# EAGLE design damp_v0002 (EAGLE 6.4)

## Sheet 1 of 2: DAC
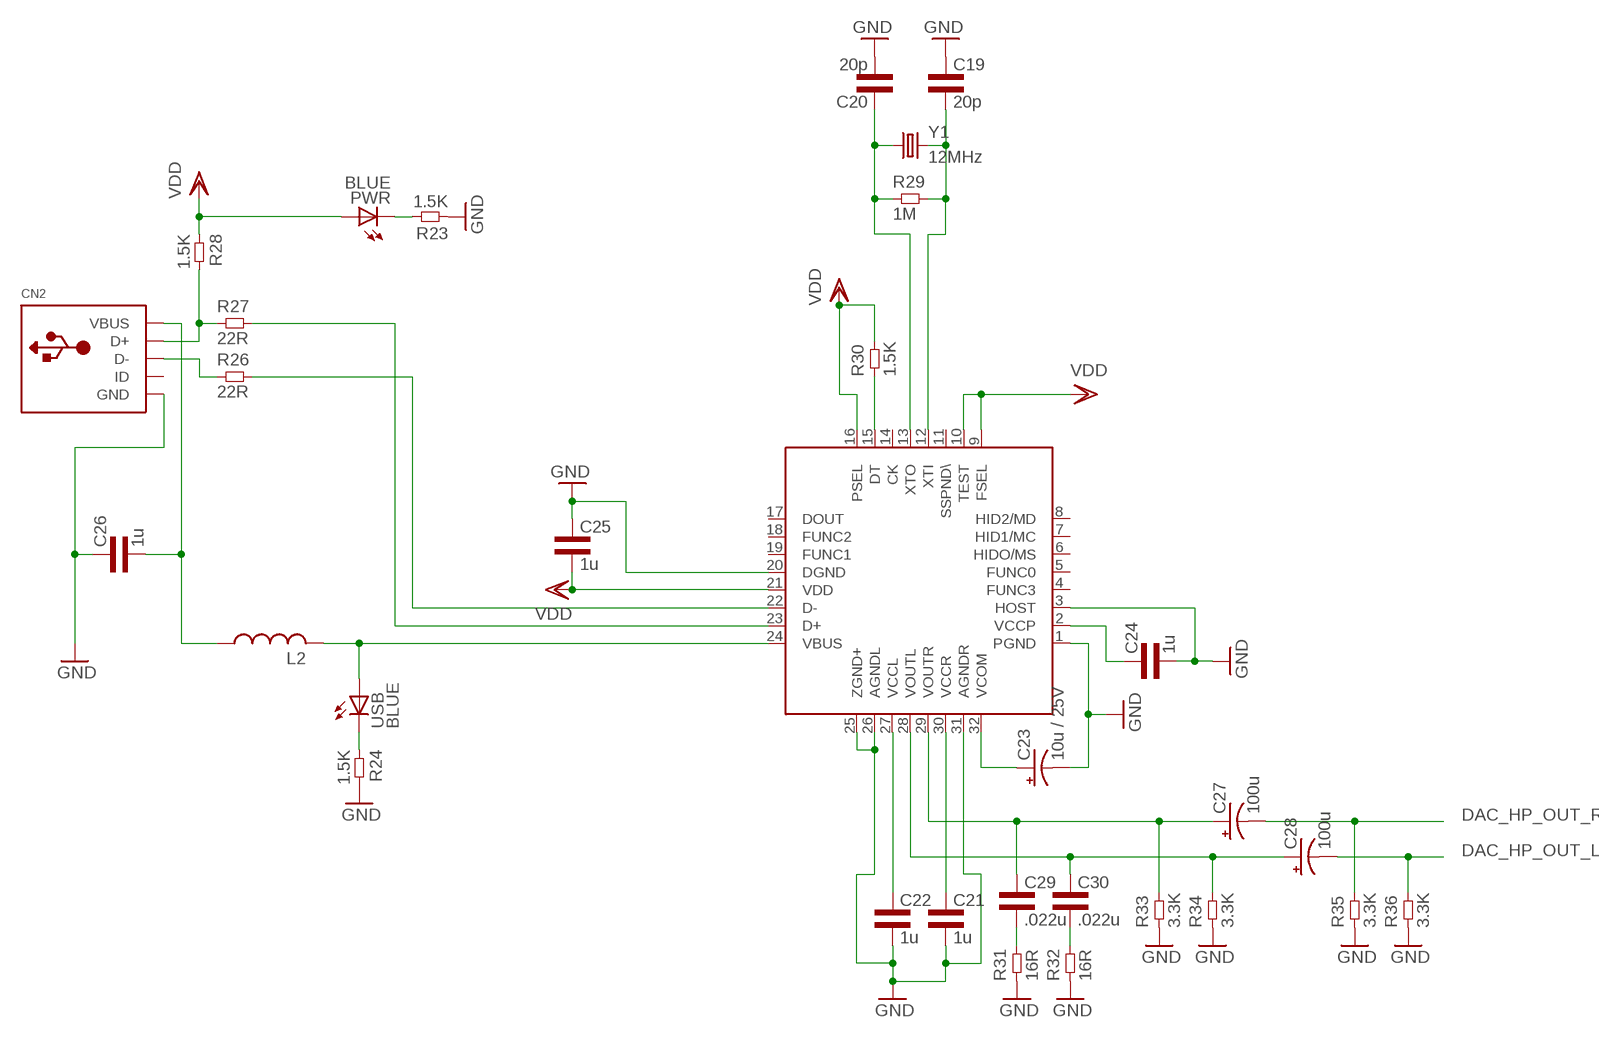
[diagram p0: schematic, sheet 1]

### Parts
C19  20p  CAP0603L3  [0603L3]
C20  20p  CAP0603L3  [0603L3]
C21  1u  CAP0603L3  [0603L3]
C22  1u  CAP0603L3  [0603L3]
C23  10u / 25V  CPOL-USE1.8-4  [E1,8-4]
C24  1u  CAP0603L3  [0603L3]
C25  1u  CAP0603L3  [0603L3]
C26  1u  CAP0603L3  [0603L3]
C27  100u  CPOL-USE2-5  [E2-5]
C28  100u  CPOL-USE2-5  [E2-5]
C29  .022u  CAP0603L3  [0603L3]
C30  .022u  CAP0603L3  [0603L3]
CN2  USBMINIB  [USB-MINIB]
L2  RCL_L-USL3225M  [RCL_L3225M]
PWR  BLUE  LED-BLUE0603  [LED-0603]
R23  1.5K  RES0603L3  [0603L3]
R24  1.5K  RES0603L3  [0603L3]
R26  22R  RES0603L3  [0603L3]
R27  22R  RES0603L3  [0603L3]
R28  1.5K  RES0603L3  [0603L3]
R29  1M  RES0603L3  [0603L3]
R30  1.5K  RES0603L3  [0603L3]
R31  16R  RES0603L3  [0603L3]
R32  16R  RES0603L3  [0603L3]
R33  3.3K  RES0603L3  [0603L3]
R34  3.3K  RES0603L3  [0603L3]
R35  3.3K  RES0603L3  [0603L3]
R36  3.3K  RES0603L3  [0603L3]
U$1  PCM2707_V1_PCM2704C_PCM2707  [PCM2707_V1_PCM2704C_PCM2707]
USB  BLUE  LED-BLUE0603  [LED-0603]
Y1  12MHz  CRYSTALHC49US  [HC49US]

### Nets
DAC_HP_OUT_L: C28.- R36.P$2 ; also sheet 2
DAC_HP_OUT_R: C27.- R35.P$2 ; also sheet 2
GND: C19.P$1 C20.P$2 C21.P$2 C22.P$2 C23.- C24.P$2 C25.P$1 C26.P$1 CN2.GND R23.P$1 R24.P$2 R31.P$1 R32.P$1 R33.P$1 R34.P$1 R35.P$1 R36.P$1 U$1.1(PGND) U$1.3(HOST) U$1.20(DGND) U$1.25(ZGND+) U$1.26(AGNDL) U$1.31(AGNDR) ; also sheet 2
N$2: PWR.C R23.P$2
N$6: R24.P$1 USB.C
N$18: CN2.D+ R27.P$1 R28.P$2
N$21: CN2.D- R26.P$1
N$37: R27.P$2 U$1.23(D+)
N$42: R26.P$2 U$1.22(D-)
N$43: C20.P$1 R29.P$1 U$1.13(XTO) Y1.1
N$44: C19.P$2 R29.P$2 U$1.12(XTI) Y1.2
N$45: C22.P$1 U$1.27(VCCL)
N$50: C21.P$1 U$1.30(VCCR)
N$51: C23.+ U$1.32(VCOM)
N$52: C29.P$2 R31.P$2
N$53: C24.P$1 U$1.2(VCCP)
N$54: C27.+ C29.P$1 R33.P$2 U$1.29(VOUTR)
N$55: L2.2 U$1.24(VBUS) USB.A
N$56: C26.P$2 CN2.VBUS L2.1
N$57: C28.+ C30.P$1 R34.P$2 U$1.28(VOUTL)
N$58: R30.P$1 U$1.15(DT)
N$59: C30.P$2 R32.P$2
VDD: C25.P$2 PWR.A R28.P$1 R30.P$2 U$1.9(FSEL) U$1.10(TEST) U$1.16(PSEL) U$1.21(VDD)
Unconnected: CN2.ID U$1.4(FUNC3) U$1.5(FUNC0) U$1.6(HIDO/MS) U$1.7(HID1/MC) U$1.8(HID2/MD) U$1.11(SSPND\) U$1.14(CK) U$1.17(DOUT) U$1.18(FUNC2) U$1.19(FUNC1)

## Sheet 2 of 2: Amp
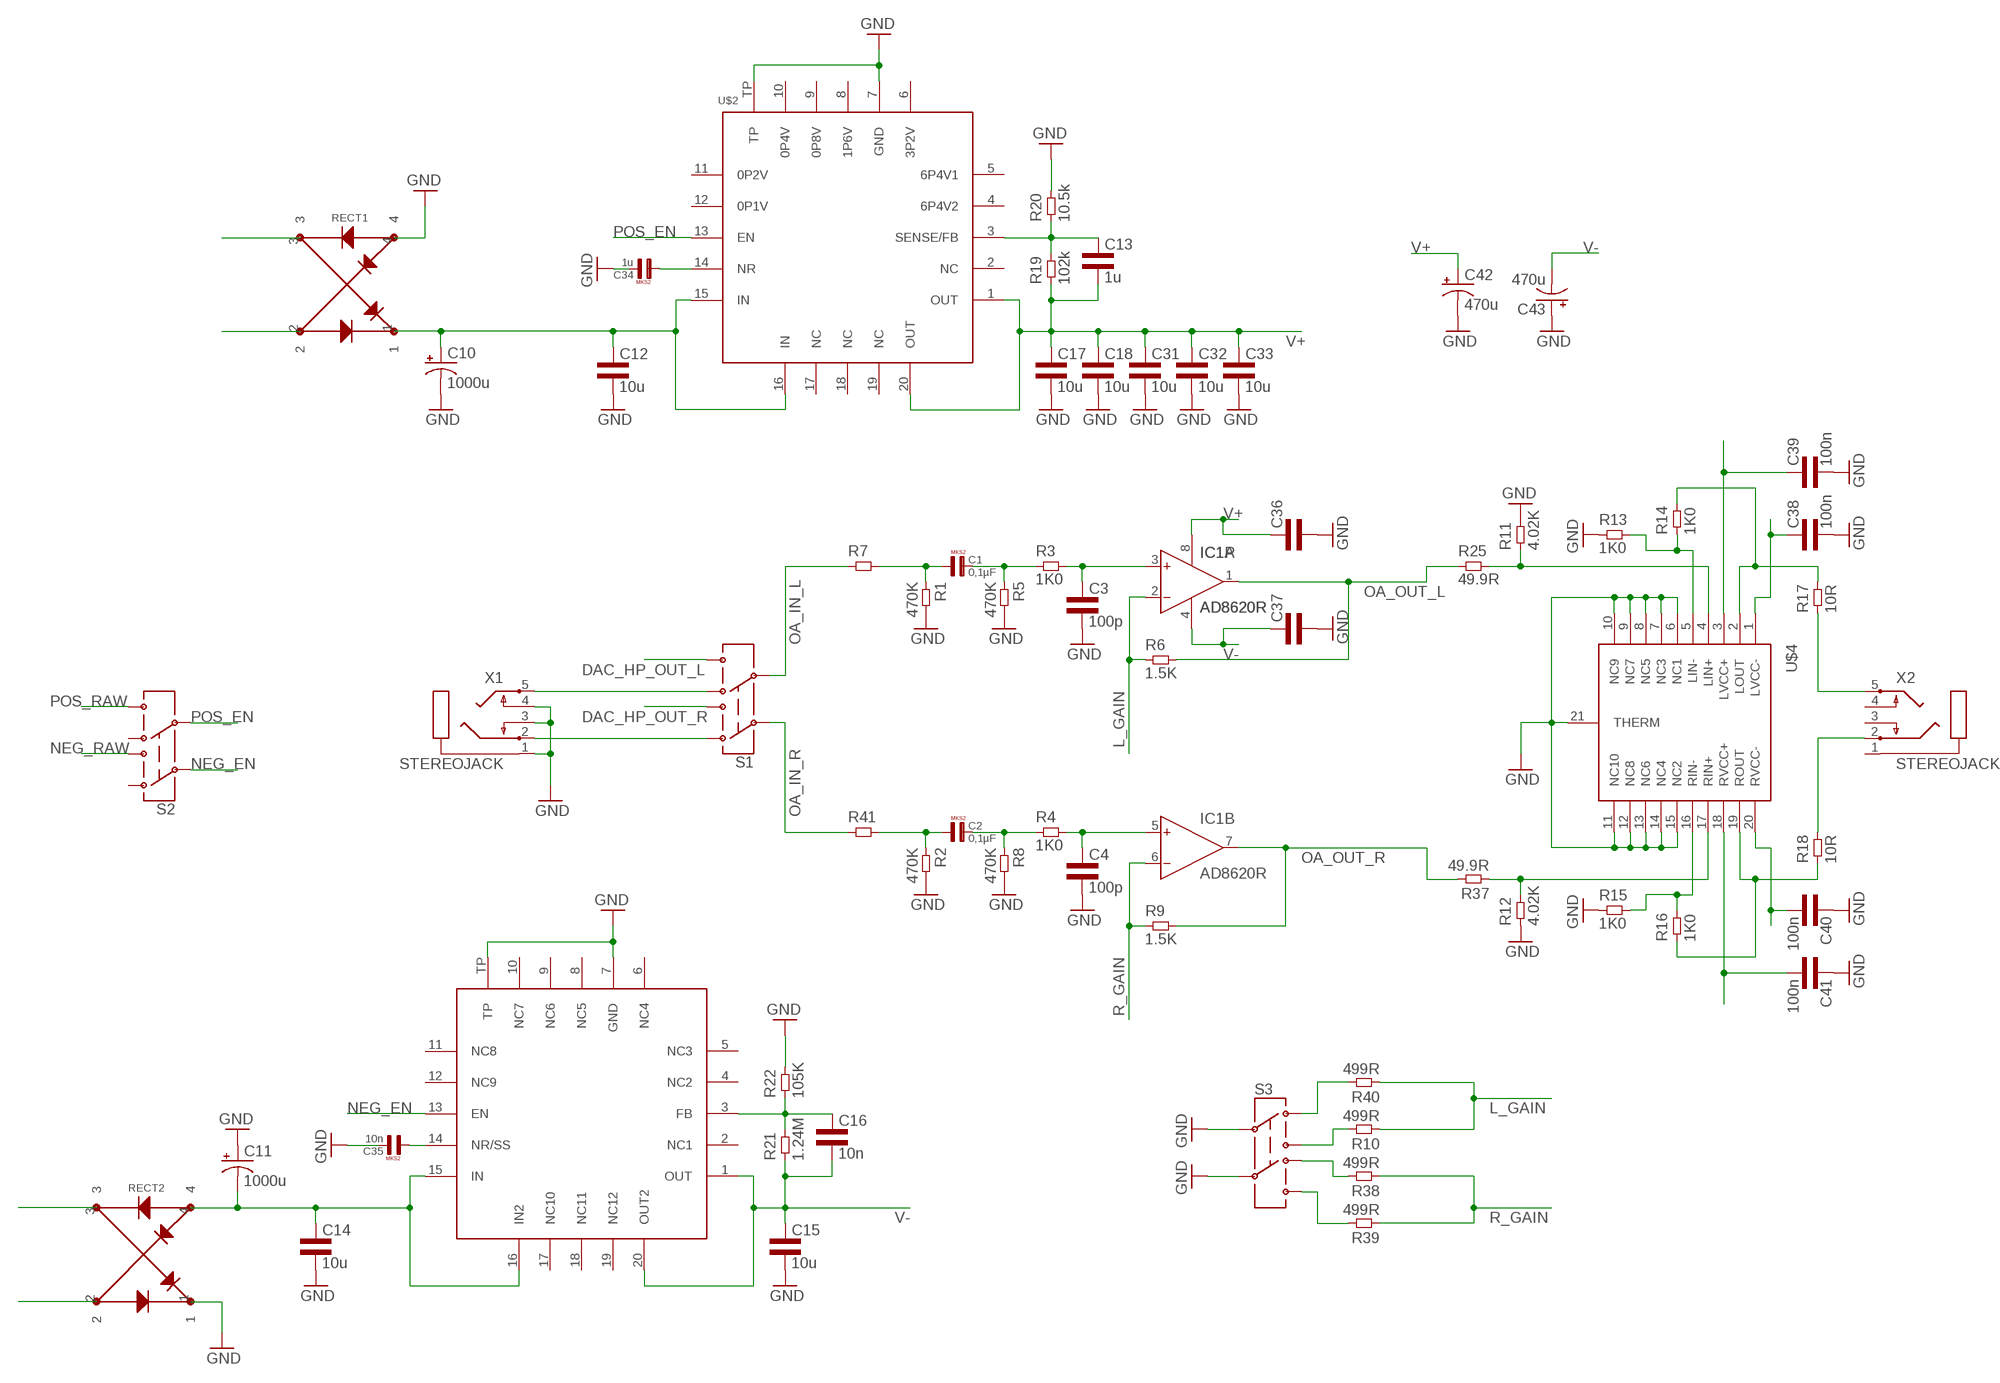
[diagram p1: schematic, sheet 2]

### Parts
C1  0,1µF  [R5B2K5]
C2  0,1µF  [R5B2K5]
C3  100p  CAP0603L3  [0603L3]
C4  100p  CAP0603L3  [0603L3]
C10  1000u  CPOL-USE7.5-16  [E7,5-16]
C11  1000u  CPOL-USE7.5-16  [E7,5-16]
C12  10u  CAP0805L3  [0805L3]
C13  1u  CAP0603L3  [0603L3]
C14  10u  CAP0805L3  [0805L3]
C15  10u  CAP0805L3  [0805L3]
C16  10n  CAP0603L3  [0603L3]
C17  10u  CAP0805L3  [0805L3]
C18  10u  CAP0805L3  [0805L3]
C31  10u  CAP0805L3  [0805L3]
C32  10u  CAP0805L3  [0805L3]
C33  10u  CAP0805L3  [0805L3]
C34  1u  1,0µF  [R5B5]
C35  10n  1,0µF  [R5B5]
C36  CAP0603L3  [0603L3]
C37  CAP0603L3  [0603L3]
C38  100n  CAP0603L3  [0603L3]
C39  100n  CAP0603L3  [0603L3]
C40  100n  CAP0603L3  [0603L3]
C41  100n  CAP0603L3  [0603L3]
C42  470u  CPOL-USE5-10.5  [E5-10,5]
C43  470u  CPOL-USE5-10.5  [E5-10,5]
IC1  AD8620R  [SO8]
R1  470K  RES0603L3  [0603L3]
R2  470K  RES0603L3  [0603L3]
R3  1K0  RES0603L3  [0603L3]
R4  1K0  RES0603L3  [0603L3]
R5  470K  RES0603L3  [0603L3]
R6  1.5K  RES0603L3  [0603L3]
R7  RES0603L3  [0603L3]
R8  470K  RES0603L3  [0603L3]
R9  1.5K  RES0603L3  [0603L3]
R10  499R  RES0603L3  [0603L3]
R11  4.02K  RES0603L3  [0603L3]
R12  4.02K  RES0603L3  [0603L3]
R13  1K0  RES0603L3  [0603L3]
R14  1K0  RES0603L3  [0603L3]
R15  1K0  RES0603L3  [0603L3]
R16  1K0  RES0603L3  [0603L3]
R17  10R  RES1206L3  [1206L3]
R18  10R  RES1206L3  [1206L3]
R19  102k  RES0603L3  [0603L3]
R20  10.5k  RES0603L3  [0603L3]
R21  1.24M  RES0603L3  [0603L3]
R22  105K  RES0603L3  [0603L3]
R25  49.9R  RES0603L3  [0603L3]
R37  49.9R  RES0603L3  [0603L3]
R38  499R  RES0603L3  [0603L3]
R39  499R  RES0603L3  [0603L3]
R40  499R  RES0603L3  [0603L3]
R41  RES0603L3  [0603L3]
RECT1  RECTIFIER_Z4GP206  [RECTIFIER_ABS-4]
RECT2  RECTIFIER_Z4GP206  [RECTIFIER_ABS-4]
S1  SWITCH-DPDTOS  [OS]
S2  SWITCH-DPDTOS  [OS]
S3  SWITCH-DPDTOS  [OS]
U$2  POWER-SUPPLY_POS_V1_TI_LDO_TPS7A4700  [POWER-SUPPLY_POS_V1_TI_LDO_VQFN-20]
U$3  POWER-SUPPLY_POS_V1_TI_LDO_TPS7A3301RGWT  [POWER-SUPPLY_POS_V1_TI_LDO_VQFN-20]
U$4  PCM2707_V1_AMP_TPA6120_TPA6120  [PCM2707_V1_AMP_TPA6120_TPA6120]
X1  STEREOJACK  [STX3100]
X2  STEREOJACK  [STX3100]

### Nets
AC1: RECT1.3
AC2: RECT1.2
AC3: RECT2.3
AC4: RECT2.2
DAC_HP_OUT_L: S1.6 ; also sheet 1
DAC_HP_OUT_R: S1.3 ; also sheet 1
GND: C3.P$2 C4.P$2 C10.- C11.+ C12.2 C14.2 C15.2 C17.2 C18.2 C31.2 C32.2 C33.2 C34.2 C35.2 C36.P$2 C37.P$2 C38.P$2 C39.P$2 C40.P$1 C41.P$1 C42.- C43.+ R1.P$2 R2.P$2 R5.P$2 R8.P$2 R11.P$2 R12.P$1 R13.P$1 R15.P$1 R20.P$2 R22.P$2 RECT1.4 RECT2.1 S3.2 S3.5 U$2.7(GND) U$2.TP U$3.7(GND) U$3.TP U$4.6(NC1) U$4.7(NC3) U$4.8(NC5) U$4.9(NC7) U$4.10(NC9) U$4.11(NC10) U$4.12(NC8) U$4.13(NC6) U$4.14(NC4) U$4.15(NC2) U$4.21(THERM) X1.1 X1.3 X1.4 ; also sheet 1
L_GAIN: IC1.2(A:IN-) R6.P$1 R10.P$1 R40.P$1
N$1: S1.4 X1.5
N$3: S1.1 X1.2
N$4: C34.1 U$2.14(NR)
N$5: R12.P$2 R37.P$1 U$4.17(RIN+)
N$7: C1.2 R3.P$1 R5.P$1
N$8: C3.P$1 IC1.3(A:IN+) R3.P$2
N$9: R11.P$1 R25.P$2 U$4.4(LIN+)
N$10: R14.P$2 R17.2 U$4.2(LOUT)
N$11: R15.P$2 R16.P$2 U$4.16(RIN-)
N$12: C2.2 R4.P$1 R8.P$1
N$13: C4.P$1 IC1.5(B:IN+) R4.P$2
N$14: R13.P$2 R14.P$1 U$4.5(LIN-)
N$15: C1.1 R1.P$1 R7.P$2
N$16: R16.P$1 R18.1 U$4.19(ROUT)
N$17: C2.1 R2.P$1 R41.P$2
N$20: R17.1 X2.5
N$22: R18.2 X2.2
N$23: C13.P$1 R19.P$2 R20.P$1 U$2.3(SENSE/FB)
N$24: C16.P$1 R21.P$2 R22.P$1 U$3.3(FB)
N$25: C35.1 U$3.14(NR/SS)
N$27: R40.P$2 S3.1
N$28: R10.P$2 S3.3
N$29: R38.P$2 S3.4
N$30: R39.P$2 S3.6
NEG_EN: S2.2 U$3.13(EN)
NEG_RAW: C11.- C14.1 RECT2.4 S2.3 U$3.15(IN) U$3.16(IN2)
OA_IN_L: R7.P$1 S1.5
OA_IN_R: R41.P$1 S1.2
OA_OUT_L: IC1.1(A:OUT) R6.P$2 R25.P$1
OA_OUT_R: IC1.7(B:OUT) R9.P$2 R37.P$2
POS_EN: S2.5 U$2.13(EN)
POS_RAW: C10.+ C12.1 RECT1.1 S2.6 U$2.15(IN) U$2.16(IN)
R_GAIN: IC1.6(B:IN-) R9.P$1 R38.P$1 R39.P$1
V+: C13.P$2 C17.1 C18.1 C31.1 C32.1 C33.1 C36.P$1 C39.P$1 C41.P$2 C42.+ IC1.8(P:V+) R19.P$1 U$2.1(OUT) U$2.20(OUT) U$4.3(LVCC+) U$4.18(RVCC+)
V-: C15.1 C16.P$2 C37.P$1 C38.P$1 C40.P$2 C43.- IC1.4(P:V-) R21.P$1 U$3.1(OUT) U$3.20(OUT2) U$4.1(LVCC-) U$4.20(RVCC-)
Unconnected: S2.1 S2.4 U$2.2(NC) U$2.4(6P4V2) U$2.5(6P4V1) U$2.6(3P2V) U$2.8(1P6V) U$2.9(0P8V) U$2.10(0P4V) U$2.11(0P2V) U$2.12(0P1V) U$2.17(NC) U$2.18(NC) U$2.19(NC) U$3.2(NC1) U$3.4(NC2) U$3.5(NC3) U$3.6(NC4) U$3.8(NC5) U$3.9(NC6) U$3.10(NC7) U$3.11(NC8) U$3.12(NC9) U$3.17(NC10) U$3.18(NC11) U$3.19(NC12) X2.1 X2.3 X2.4

## Library data of the parts
C1 C2 = Capacitor-Wima-MKS2-63v:0,1µF
C3 C4 C12-C22 C24-C26 C29-C33 C36-C41 = common:CAP
C10 C11 C23 C27 C28 C42 C43 = rcl:CPOL-US: POLARIZED CAPACITOR, American symbol
C34 C35 = Capacitor-Wima-MKS2-63v:1,0µF
CN2 = adafruit:USB: USB Connectors USBMINIB - Surface Mount Female Mini-B USB Connector 4UConnector: 06564 By microbuilder.eu Thru-hole RA Female Mini-B USB Connector 4UConnector: 18732 By ladyada.net
IC1 = analog-devices:AD8620: Precision, Very Low Noise, Low Input Bias Current, Wide Bandwidth JFET Operational Amplifiers Source: http://www.analog.com/static/imported-files/data_sheets/AD8610_8620.pdf; MF: ALTERA CORPORATION; MPN: AD8620ARZ; OC_FARNELL: 9994386; OC_NEWARK: 59K6972
L2 = pcm2707_v1:RCL_L-US: INDUCTOR, American symbol
PWR USB = SparkFun-LED:LED-BLUE: Blue LEDs for production use Various blue LEDs stocked by SparkFun production 0603 - DIO-08575 Rebel - DIO-09553 1206 - DIO-09911; PROD_ID: DIO-08575
R1-R41 = common:RES
RECT1 RECT2 = my_dac_amp:RECTIFIER_Z4GP206
S1-S3 = SparkFun-Electromechanical:SWITCH-DPDT: DPDT Version of the COM-00597
U$1 = my_dac_amp:PCM2707_V1_PCM2704C_PCM2707: Upgraded version of the PCM2704. It allows connecting to a device with USB and transmitting that data to another DAC using I2S protocol. Also has other advanced features that allow control with SPI, external buttons, etc.
U$2 = my_dac_amp:POWER-SUPPLY_POS_V1_TI_LDO_TPS7A4700
U$3 = my_dac_amp:POWER-SUPPLY_POS_V1_TI_LDO_TPS7A3301RGWT: Ultra-Low Noise NEGATIVE Voltage Reglator
U$4 = my_dac_amp:PCM2707_V1_AMP_TPA6120_TPA6120
X1 X2 = adafruit:STEREOJACK: MIC/HEADPHONE JACK Stereo jack with two switches. Kycon STX3100, CUI SJ1-3555NG and/or 4UCon 05544
Y1 = SparkFun-FreqCtrl:CRYSTAL: Various standard crystals. Proven footprints. Spark Fun Electronics SKU : COM-00534

## Board
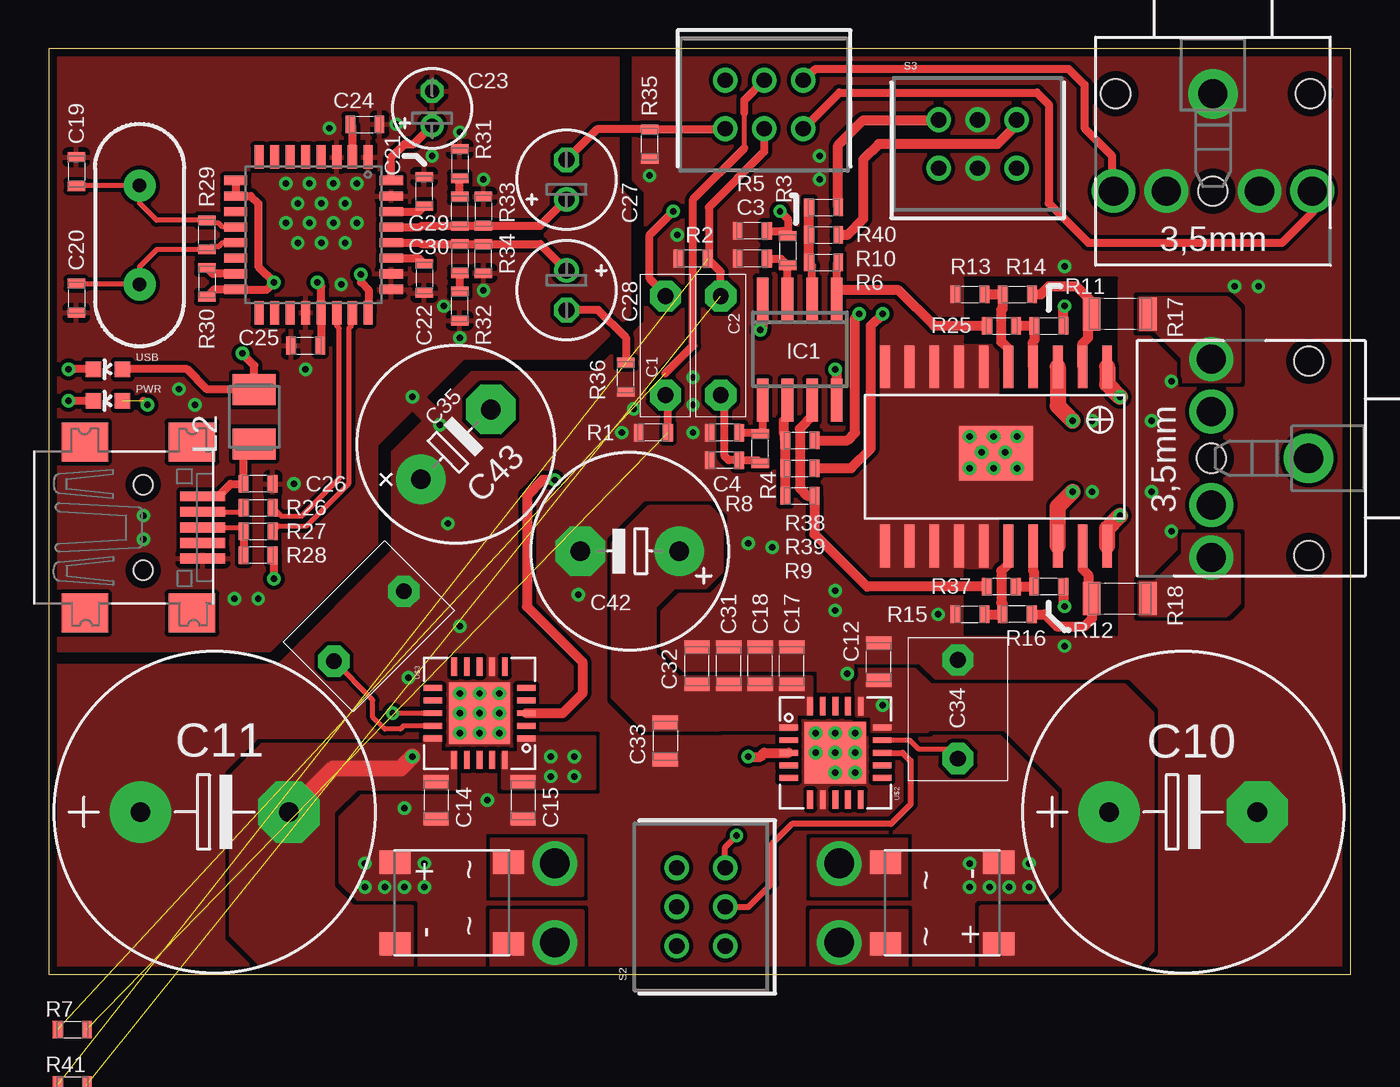
[diagram p2: board, top side]
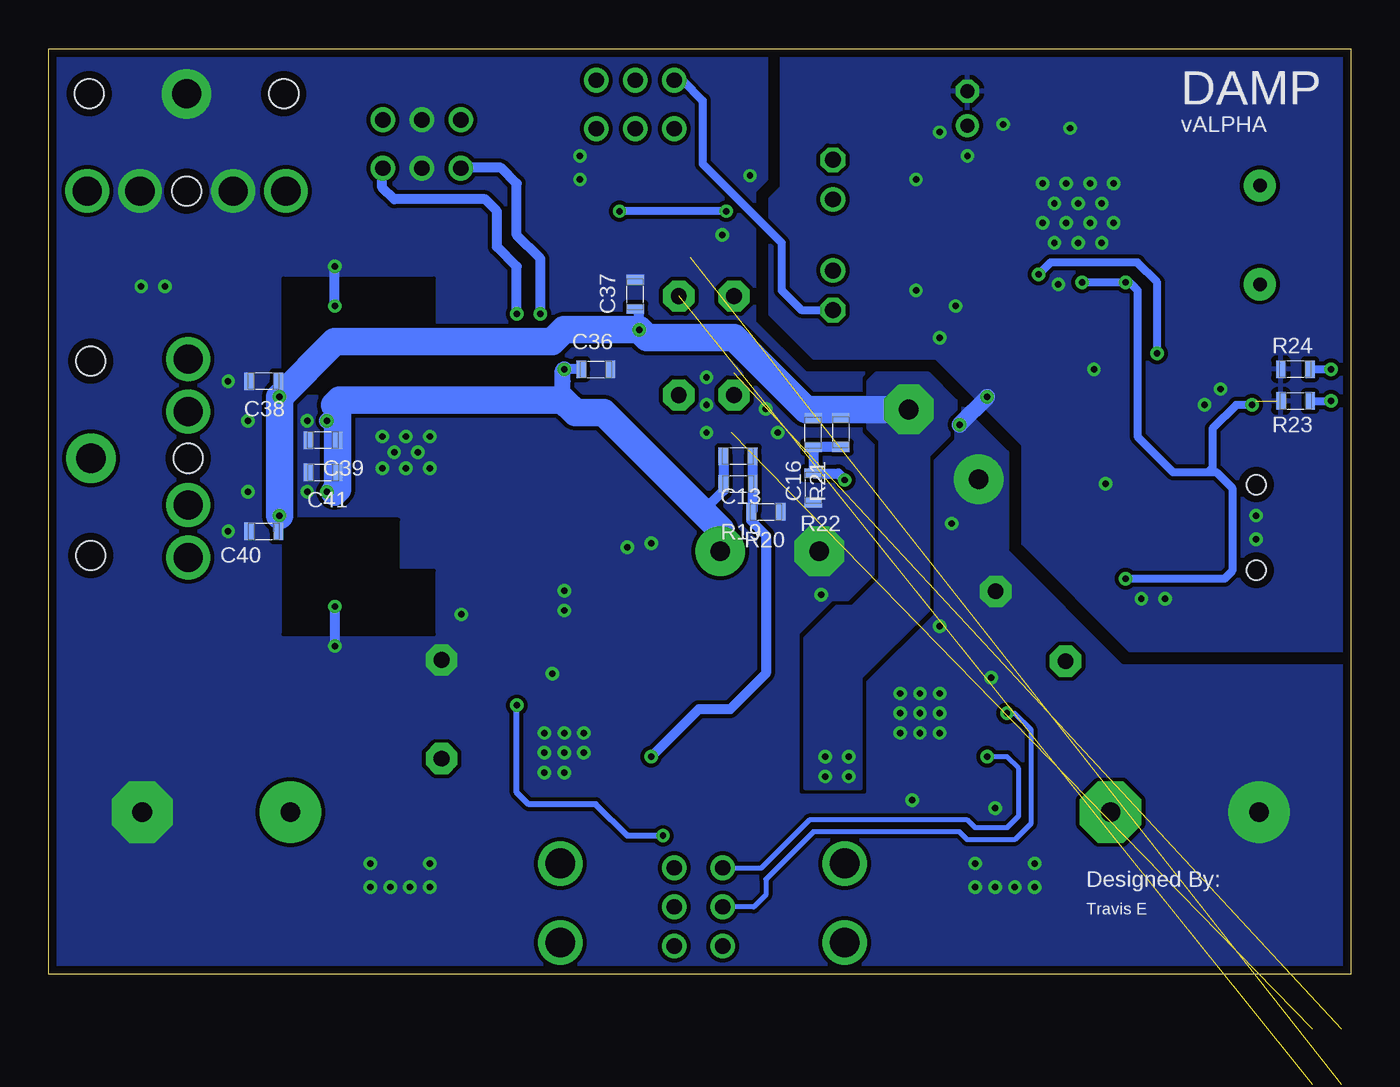
[diagram p3: board, bottom side, seen from below]

Size 66.93 x 47.57 mm. Coordinates in mm from the lower left corner, seen from the top.
Outline: 0,0 66.93,0 66.93,47.57 0,47.57 0,0
Copper layers (1*16): Top 0.035mm / dielectric 1.5mm / Bottom 0.035mm
Design rules "default *": minimum track width 8mil, minimum drill 13mil, track to track 8mil, track to pad 8mil, pad to pad 8mil, via to via 8mil, smd to smd 8mil, copper to edge 16mil, drill to drill 8mil, minimum pad ring 7mil, minimum via ring 7mil, stop-mask expansion 4mil, vias tented up to drill 18mil, thermal gap 10mil
tRestrict: area 47.1,29.9 to 54.9,35.8; area 47.1,17.5 to 54.9,23.4
bRestrict: area 47.1,29.9 to 54.9,35.8; area 47.1,17.5 to 54.9,23.4

### Footprints (pad centres in the part's own frame; a part is rotated, then mirrored left to right if it is on the bottom)
R5B2K5 = drill 0.813 pad 1.6 octagon: 1 -2.54,0; 2 2.54,0
0603L3 = smd 0.5 x 0.9: P$1 -0.75,0; P$2 0.75,0
E7,5-16 = drill 1.016 pad 3.15: + -3.81,0 | drill 1.016 pad 3.15 octagon: - 3.81,0
0805L3 = smd 0.7 x 1.3: 1 -0.95,0; 2 0.95,0
E1,8-4 = drill 0.711 pad 1.168: + -0.889,0 | drill 0.711 pad 1.168 octagon: - 0.889,0
E2-5 = drill 0.813 pad 1.27: + -1.016,0 | drill 0.813 pad 1.27 octagon: - 1.016,0
R5B5 = drill 0.813 pad 1.6 octagon: 1 -2.54,0; 2 2.54,0
E5-10,5 = drill 1.016 pad 2.54: + -2.54,0 | drill 1.016 pad 2.54 octagon: - 2.54,0
USB-MINIB = smd 0.5 x 2.308: D+ 0,4.064; D- -0.8,4.064; GND 1.6,4.064; ID 0.8,4.064; VBUS -1.6,4.064 | smd 2 x 2.4: GND1 -4.4,-2; GND2 -4.4,3.5; GND3 4.4,3.5; GND4 4.4,-2 | hole 1: -2.2,1; 2.2,1
SO8 = smd 0.6 x 2.2: 1 -1.905,-2.6; 2 -0.635,-2.6; 3 0.635,-2.6; 4 1.905,-2.6; 5 1.905,2.6; 6 0.635,2.6; 7 -0.635,2.6; 8 -1.905,2.6
RCL_L3225M = smd 1.6 x 2.2: 1 -1.4,0; 2 1.4,0
LED-0603 = smd 0.8 x 0.8: A 0,-0.75; C 0,0.75
1206L3 = smd 0.9 x 1.7: 1 -1.45,0; 2 1.45,0
RECTIFIER_ABS-4 = smd 1.2 x 1.6: 1 2.1,2.91; 2 2.1,-2.91; 3 -2.1,-2.91; 4 -2.1,2.91
OS = drill 0.787 pad 1.27: 1 -2.007,1.245; 2 0,1.245; 3 2.007,1.245; 4 -2.007,-1.245; 5 0,-1.245; 6 2.007,-1.245
PCM2707_V1_PCM2704C_PCM2707 = smd 0.47 x 1.2: 1 -2.8,-4; 2 -2,-4; 3 -1.2,-4; 4 -0.4,-4; 5 0.4,-4; 6 1.2,-4; 7 2,-4; 8 2.8,-4; 17 2.8,4; 18 2,4; 19 1.2,4; 20 0.4,4; 21 -0.4,4; 22 -1.2,4; 23 -2,4; 24 -2.8,4 | smd 1.2 x 0.47: 9 4,-2.8; 10 4,-2; 11 4,-1.2; 12 4,-0.4; 13 4,0.4; 14 4,1.2; 15 4,2; 16 4,2.8; 25 -4,2.8; 26 -4,2; 27 -4,1.2; 28 -4,0.4; 29 -4,-0.4; 30 -4,-1.2; 31 -4,-2; 32 -4,-2.8
POWER-SUPPLY_POS_V1_TI_LDO_VQFN-20 = smd 0.3 x 0.95: 1 -1.3,-2.4; 2 -0.65,-2.4; 3 0,-2.4; 4 0.65,-2.4; 5 1.3,-2.4; 11 1.3,2.4; 12 0.65,2.4; 13 0,2.4; 14 -0.65,2.4; 15 -1.3,2.4 | smd 0.95 x 0.3: 6 2.4,-1.3; 7 2.4,-0.65; 8 2.4,0; 9 2.4,0.65; 10 2.4,1.3; 16 -2.4,1.3; 17 -2.4,0.65; 18 -2.4,0; 19 -2.4,-0.65; 20 -2.4,-1.3 | smd 3.15 x 3.15: TP 0,0
PCM2707_V1_AMP_TPA6120_TPA6120 = smd 0.5 x 2.2: 1 0.25,1.095; 2 1.52,1.095; 3 2.79,1.095; 4 4.06,1.095; 5 5.33,1.095; 6 6.6,1.095; 7 7.87,1.095; 8 9.14,1.095; 9 10.41,1.095; 10 11.68,1.095; 11 11.68,10.295; 12 10.41,10.295; 13 9.14,10.295; 14 7.87,10.295; 15 6.6,10.295; 16 5.33,10.295; 17 4.06,10.295; 18 2.79,10.295; 19 1.52,10.295; 20 0.25,10.295 | smd 3.81 x 2.79: 21 5.965,5.54
STX3100 = drill 1.5 pad 2.54: 1 2.7,-0.1 | drill 1.5: 2 7.7,5; 3 7.7,2.3; 4 7.7,-2.5; 5 7.7,-5.2 | hole 1.5: 2.7,4.9; 2.7,-5.1; 7.7,-0.1
HC49US = drill 0.7 pad 1.651: 1 -2.54,0; 2 2.54,0

### Placement (x,y rotation side)
C1  31.7,32.31 90 top
C2  34.54,32.31 270 top
C3  36.17,36.78 180 top
C4  34.75,27.84 180 top
C10  58.32,8.33 0 top
C11  8.53,8.33 0 top
C12  42.67,16.05 90 top
C13  31.5,26.62 180 bottom
C14  19.91,8.94 270 top
C15  24.38,8.94 270 top
C16  27.64,27.84 90 bottom
C17  38.2,15.85 90 top
C18  36.58,15.85 90 top
C19  1.42,41.25 270 top
C20  1.42,34.75 270 top
C21  19.3,40.23 90 top
C22  19.3,35.76 270 top
C23  19.71,44.5 90 top
C24  16.26,43.69 0 top
C25  13.21,32.31 0 top
C26  10.77,25.2 180 top
C27  26.62,40.84 90 top
C28  26.62,35.15 270 top
C29  21.13,39.22 90 top
C30  21.13,36.78 270 top
C31  34.95,15.85 90 top
C32  33.32,15.85 90 top
C33  31.7,11.99 270 top
C34  46.74,13.61 90 top
C35  16.46,17.88 45 top
C36  38.81,31.09 0 bottom
C37  36.78,34.95 90 bottom
C38  55.88,30.48 180 bottom
C39  52.83,27.43 180 bottom
C40  55.88,22.76 0 bottom
C41  52.83,25.81 0 bottom
C42  29.87,21.74 180 top
C43  20.93,27.23 45 top
CN2  3.86,22.96 270 top
IC1  38.61,32.11 180 top
L2  10.57,28.65 90 top
PWR  3.05,29.46 90 top
R1  31.09,27.84 180 top
R2  33.12,36.78 180 top
R3  38,37.19 270 top
R4  36.58,27.03 90 top
R5  36.17,38.2 180 top
R6  39.83,36.58 0 top
R7  1.22,-2.84 0 top
R8  34.75,26.42 180 top
R9  38.61,24.59 0 top
R10  39.83,38 0 top
R11  51.41,33.32 0 top
R12  51.41,19.91 180 top
R13  47.35,34.95 0 top
R14  49.78,34.95 0 top
R15  47.35,18.49 0 top
R16  49.78,18.49 180 top
R17  55.07,33.93 180 top
R18  55.07,19.3 0 top
R19  31.5,25.2 0 bottom
R20  30.07,23.77 0 bottom
R21  26.21,27.84 270 bottom
R22  27.64,24.99 270 bottom
R23  2.84,29.46 0 bottom
R24  2.84,31.09 180 bottom
R25  48.97,33.32 0 top
R26  10.77,23.98 0 top
R27  10.77,22.76 0 top
R28  10.77,21.54 180 top
R29  8.13,38 90 top
R30  8.13,35.56 270 top
R31  21.13,41.66 270 top
R32  21.13,34.34 90 top
R33  22.35,39.22 270 top
R34  22.35,36.78 90 top
R35  30.89,42.67 90 top
R36  29.67,30.68 90 top
R37  48.97,19.91 180 top
R38  38.61,27.43 0 top
R39  38.61,26.01 0 top
R40  39.83,39.42 0 top
R41  1.22,-5.69 0 top  (outside the outline)
RECT1  45.92,3.66 270 top
RECT2  20.73,3.66 90 top
S1  36.78,44.7 180 top
S2  33.53,3.45 90 top
S3  47.75,42.67 0 top
U$1  13.61,38 180 top
U$2  40.44,11.38 270 top
U$3  22.15,13.41 90 top
U$4  54.66,32.31 180 top
USB  3.05,31.09 90 top
X1  59.94,47.96 270 top
X2  67.46,26.42 180 top
Y1  4.67,38 90 top

### Tracks (layer width: path | path; a pad name or v marks a point on that pad's centre or on a via)
AC1  (via drill 1.52)
  other vias: 40.64,5.69
  pour Top (no thermals): 39.22,4.06 44.09,4.06 44.09,6.91 39.22,6.91
AC2  (via drill 1.52)
  other vias: 40.64,1.63
  pour Top (no thermals): 39.22,3.25 44.09,3.25 44.09,0.41 39.22,0.41
AC3  (via drill 1.52)
  other vias: 26.01,1.63
  pour Top (no thermals): 22.76,3.25 27.43,3.25 27.43,0.41 22.76,0.41
AC4  (via drill 1.52)
  other vias: 26.01,5.69
  pour Top (no thermals): 22.76,5.08 22.76,4.06 27.43,4.06 27.43,6.91 22.76,6.91
DAC_HP_OUT_L
  Top 0.406: R36.P$2 29.67,32.72 28.25,34.14 C28.-
  Bottom 0.406: S1.6 34.37,45.95 33.33,44.91 33.33,41.66 29.26,37.59 29.26,35.15 28.25,34.14 C28.-
DAC_HP_OUT_R
  Top 0.406: S1.3 34.73,43.42 R35.P$2 28.18,43.42 C27.-
GND  (via drill 0.33)
  Top 0.508: R11.P$2 52.16,34.28 v52.22,34.34 | R12.P$1 52.16,18.96 v52.22,18.9
  Bottom 0.508: v52.22,18.9 v52.22,16.87 | v52.22,34.34 v52.22,36.37
  Bottom 0.813: v18.69,29.67 v20.12,28.24
  other vias: 21.13,17.88 27.23,19.51 22.56,8.94 18.29,8.53 29.46,27.84 33.12,27.84 20.52,23.16 35.97,22.15 37.19,21.95 40.44,18.69 40.44,19.71 30.07,29.06 39.62,40.84 39.62,42.06 17.88,43.69 19.71,42.06 21.13,43.28 22.35,40.84 22.35,35.15 21.13,32.72 20.32,34.34 13.21,31.09 12.6,25.2 45.72,18.49 62.18,35.36 60.96,35.36 30.89,41.05 32.31,38 57.71,22.76 57.71,30.48 56.69,28.45 56.69,24.79 16.26,5.69 19.3,5.69 47.35,5.69 50.39,5.69 18.49,15.24 12.19,40.64 13.41,40.64 14.63,40.64 15.85,40.64 12.8,39.62 14.02,39.62 15.24,39.62 15.85,38.61 14.63,38.61 13.41,38.61 12.19,38.61 12.8,37.59 14.02,37.59 15.24,37.59 47.35,27.64 47.35,26.01 47.96,26.82 48.56,27.64 48.56,26.01 49.17,26.82 49.78,27.64 49.78,26.01 41.45,10.36 41.05,15.44 40.44,10.36 41.45,11.38 40.44,11.38 39.42,11.38 41.45,12.4 40.44,12.4 39.42,12.4 21.13,14.43 22.15,14.43 23.16,14.43 22.15,13.41 22.15,12.4 21.13,13.41 23.16,13.41 23.16,12.4 21.13,12.4 15.04,35.46 14.43,43.48 6.71,30.07 7.52,29.26 4.88,22.35 4.88,23.57 9.55,19.3 10.77,19.3 33.12,30.68 33.12,29.26 16.26,4.47 19.3,4.47 17.27,4.47 18.29,4.47 47.35,4.47 50.39,4.47 48.36,4.47 49.38,4.47 53.64,24.79 53.64,28.45
  pour Top (rank 6): 0.41,16.66 11.38,16.66 16.87,22.15 16.87,27.23 21.34,31.7 27.64,31.7 29.87,33.93 29.87,39.83 29.26,40.44 29.26,47.14 0.41,47.14
  pour Bottom: 29.26,47.14 29.26,40.44 29.87,39.83 29.87,33.93 27.64,31.7 21.34,31.7 16.87,27.23 16.87,22.15 11.38,16.66 0.41,16.66 0.41,47.14
  pour Bottom (rank 6, no thermals): 30.07,47.14 30.07,40.84 30.68,40.23 30.68,33.53 28.04,30.89 21.74,30.89 17.68,26.82 17.68,21.74 11.79,15.85 0.41,15.85 0.41,0.41 66.45,0.41 66.45,47.14
  pour Top (rank 6, no thermals): 30.07,47.14 30.07,40.84 30.68,40.23 30.68,33.53 28.04,30.89 21.74,30.89 17.68,26.82 17.68,21.74 11.79,15.85 0.41,15.85 0.41,0.41 66.45,0.41 66.45,47.14
  pour Top: 20.12,27.64 20.52,27.64 20.73,27.84 20.73,28.24 18.69,30.28 18.29,30.28 18.08,30.07 18.08,29.67
L_GAIN
  Top 0.406: IC1.2 39.24,36.41 R6.P$1
  Top 0.508: R6.P$1 R10.P$1 R40.P$1
N$1
  Top 0.406: S1.4 38.84,45.95 39.42,46.53 52.43,46.53 53.24,45.72 53.24,43.48 54.66,42.06 54.66,40.34 X1.5
N$2  (via drill 0.33)
  Top 0.406: PWR.C v1.02,29.46
  Bottom 0.406: R23.P$2 v1.02,29.46
N$3
  Top 0.406: S1.1 40.64,45.31 50.8,45.31 51.41,44.7 51.41,39.62 53.44,37.59 63.4,37.59 65.02,39.22 65.02,40.18 X1.2
N$4
  Top 0.254: U$2.14 44.26,12.03 44.7,11.58 46.23,11.58 C34.1
N$5
  Top 0.508: U$4.17 50.6,20.73 50.66,20.66 R12.P$2 R37.P$1
N$6  (via drill 0.33)
  Top 0.406: USB.C v1.02,31.09
  Bottom 0.406: R24.P$1 v1.02,31.09
N$7  (via drill 0.33)
  Top 0.406: R5.P$1 37.73,38.2 R3.P$1 38,38.81 v37.59,39.22 | C1.2 31.7,34.95 30.89,35.76 30.89,38 v32.11,39.22
  Bottom 0.406: v32.11,39.22 v37.59,39.22
N$8
  Top 0.406: IC1.3 37.97,36.41 R3.P$2 37.66,36.78 C3.P$1
N$9
  Top 0.508: R25.P$2 R11.P$1 50.66,32.57 50.6,32.51 U$4.4
N$10
  Top 0.508: R14.P$2 51,34.95 51.41,35.36 52.83,35.36 53.62,34.57 R17.2 53.44,33.76 53.44,32.72 53.14,32.41 U$4.2
N$11
  Top 0.508: U$4.16 49.33,21.09 48.97,20.73 48.97,19.1 49.03,19.04 R16.P$2 R15.P$2
N$12
  Top 0.406: R4.P$1 36.44,26.42 R8.P$1 34.95,26.42 34.75,26.62 34.75,29.57 C2.2
N$13
  Top 0.406: IC1.5 36.7,27.9 R4.P$2 36.51,27.84 C4.P$1
N$14
  Top 0.254: 48.16,34.75 R13.P$2
  Top 0.508: U$4.5 49.33,32.15 48.97,32.51 48.97,34.14 49.03,34.2 R14.P$1 R13.P$2
N$15  (1 unrouted)
  Top 0.406: R1.P$1 31.84,29.63 C1.1
N$16
  Top 0.508: R16.P$1 51.21,18.49 51.82,17.88 53.24,17.88 53.65,18.29 53.65,19.28 R18.1 53.44,19.48 53.44,20.52 53.14,20.82 U$4.19
N$17  (1 unrouted)
  Top 0.406: C2.1 34.54,36.11 R2.P$1
N$18
  Top 0.254: CN2.D+ 9.82,22.96 R27.P$1
  Top 0.406: R27.P$1 R28.P$2
N$20
  pour Top (no thermals): 56.08,34.75 60.55,34.75 61.16,34.14 61.16,30.48 58.32,30.48 58.32,31.7 56.9,33.12 56.08,33.12
N$21
  Top 0.254: CN2.D- 9.8,23.76 R26.P$1
N$22
  pour Top (no thermals): 56.08,18.49 60.55,18.49 61.16,19.1 61.16,22.56 58.32,22.56 58.32,21.54 56.9,20.12 56.08,20.12
N$23  (via drill 0.33)
  Top 0.508: v35.97,11.18 36.58,11.18 36.78,11.38 U$2.3
  Bottom 0.508: C13.P$1 R19.P$2 30.75,23.85 R20.P$1 30.82,23.31 30.07,22.56 30.07,15.44 31.9,13.61 33.53,13.61 v35.97,11.18
N$24  (via drill 0.33)
  Top 0.508: U$3.3 26.42,13.41 27.43,14.43 27.43,16.05 24.59,18.9 24.59,24.59 25.4,25.4 v26.01,25.4
  Bottom 0.508: R21.P$2 C16.P$1 R22.P$1 26.35,25.74 v26.01,25.4
N$25
  Top 0.254: U$3.14 18.25,12.76 18.09,12.6 17.27,12.6 16.66,13.21 16.66,14.09 C35.1
N$27
  Top 0.508: R40.P$2 40.58,42.61 41.86,43.89 45.72,43.89 S3.1
N$28
  Top 0.508: S3.3 49.76,43.66 48.77,42.67 42.67,42.67 41.86,41.86 41.86,38.81 41.05,38 R10.P$2
N$29  (via drill 0.33)
  Top 0.508: R38.P$2 41.05,27.43 41.45,27.84 41.45,33.73 v41.66,33.93
  Bottom 0.508: v41.66,33.93 41.66,36.78 42.88,38 42.88,40.64 43.69,41.45 45.72,41.45 S3.4
N$30  (via drill 0.33)
  Top 0.508: R39.P$2 41.25,26.01 42.27,27.03 42.27,33.32 v42.88,33.93
  Bottom 0.508: v42.88,33.93 42.88,36.37 43.89,37.39 43.89,39.22 44.5,39.83 49.17,39.83 49.78,40.44 49.78,41.4 S3.6
N$37
  Top 0.254: U$1.23 15.57,33.95 15.57,33.32 15.44,33.2 15.44,25.22 13.26,23.04 11.8,23.04 R27.P$2
N$42
  Top 0.254: U$1.22 14.81,33.32 14.94,33.2 14.94,25.48 13.01,23.55 11.95,23.55 R26.P$2
N$43
  Top 0.254: U$1.13 8.95,37.6 8.74,37.39 8.27,37.39 R29.P$1 5.55,37.25 4.67,36.37 Y1.1 1.46,35.46 C20.P$1
N$44
  Top 0.254: U$1.12 8.95,38.4 8.74,38.61 8.27,38.61 R29.P$2 5.55,38.75 4.67,39.62 Y1.2 1.46,40.54 C19.P$2
N$45
  Top 0.406: U$1.27 19.02,36.8 C22.P$1
N$50
  Top 0.406: U$1.30 19.02,39.2 C21.P$1
N$51
  Top 0.406: U$1.32 17.61,42 18.29,42.67 18.77,42.67 C23.+
N$52
  Top 0.406: C29.P$2 R31.P$2
N$53
  Top 0.406: U$1.2 15.61,43.58 C24.P$1
N$54
  Top 0.406: U$1.29 19.1,38.4 19.16,38.47 C29.P$1 R33.P$2 25.26,38.47 C27.+
N$55  (via drill 0.33)
  Top 0.406: v9.96,31.9 10.57,31.29 L2.2 8.15,30.05 7.11,31.09 USB.A | v16.05,35.97 16.05,35.56 16.46,35.15 16.46,34.04 U$1.24
  Bottom 0.406: v9.96,31.9 9.96,35.56 10.97,36.58 15.44,36.58 v16.05,35.97
N$56
  Top 0.406: CN2.VBUS 8.71,24.56 9.35,25.2 C26.P$2 10.02,26.7 L2.1
N$57
  Top 0.406: U$1.28 19.1,37.59 19.16,37.53 C30.P$1 R34.P$2 25.26,37.53 C28.+
N$58
  Top 0.406: U$1.15 8.44,36 R30.P$1
N$59
  Top 0.406: C30.P$2 R32.P$2
NEG_EN  (via drill 0.33)
  Top 0.254: U$3.13 v17.68,13.41
  Bottom 0.254: v17.68,13.41 17.27,13.41 16.46,12.6 16.46,7.72 17.27,6.91 19.71,6.91 20.12,7.32 27.64,7.32 30.07,4.88 30.07,4.06 30.68,3.45 S2.2
NEG_RAW  (via drill 0.33)
  Top 0.813: C11.- 12.39,8.33 14.63,10.57 18.09,10.57 v18.69,11.18
  Bottom 0.254: S2.3 30.3,5.46 27.84,7.92 19.71,7.92 19.3,7.52 17.68,7.52 17.07,8.13 17.07,10.57 17.68,11.18 v18.69,11.18
  pour Top (no thermals): 20.12,12.19 19.3,12.19 19.3,11.79 18.08,11.79 18.08,9.55 20.93,9.55 20.93,11.38 20.12,11.38
  pour Top (no thermals): 18.69,0.41 18.69,3.45 15.65,3.45 14.63,4.47 14.63,8.33 15.85,9.55 19.1,9.55 19.1,11.79 10.97,11.79 9.35,10.16 9.35,2.03 10.97,0.41
OA_IN_L  (1 unrouted)
  Top 0.254: 35.76,42.47 35.76,44.3
  Top 0.406: 31.7,30.89 33.12,32.31 33.12,39.83 35.76,42.47 | 35.76,44.3 35.76,44.93 S1.5
OA_IN_R  (1 unrouted)
  Top 0.406: S1.2 36.78,42.27 33.93,39.42 33.93,36.84
OA_OUT_L
  Top 0.406: IC1.1 40.51,35.36 40.51,36.51 R6.P$2
  Top 0.508: R25.P$1 45.52,33.32 43.69,35.15 40.72,35.15 40.51,35.36
OA_OUT_R
  Top 0.508: R37.P$2 42.06,19.91 39.36,22.62 R9.P$2 39.01,24.59 38.61,24.99 38.61,28.04 39.24,28.68 IC1.7
POS_EN
  Top 0.305: U$2.13 43.89,11.38 44.3,10.97 44.3,8.74 43.28,7.72 38.2,7.72 37.19,6.71 37.19,4.67 35.97,3.45 S2.5
POS_RAW  (via drill 0.33)
  Top 0.305: S2.6 34.77,6.53 v35.36,7.11
  Bottom 0.305: v35.36,7.11 37.19,7.11 38.81,8.74 42.27,8.74 42.88,9.35 v42.88,13.82
  pour Top (no thermals): 41.55,13.31 41.55,15.65 44.5,15.65 45.31,14.83 55.27,14.83 56.69,13.41 56.69,1.22 55.88,0.41 47.96,0.41 47.96,3.45 51.41,3.45 52.22,4.27 52.22,9.55 49.17,12.6 45.21,12.6 45.11,12.5 42.37,12.5 42.37,13.31
R_GAIN
  Top 0.508: IC1.6 37.97,28.63 37.8,28.45 37.8,27.84 37.86,27.78 R38.P$1 R39.P$1 R9.P$1
V+  (via drill 0.33)
  Top 0.508: IC1.8 40.51,31.01 v40.44,31.09
  Top 0.813: U$4.3 51.87,29.21 v52.63,28.45 | U$4.18 51.87,24.03 v52.63,24.79
  Bottom 0.254: 40.23,30.48 40.23,30.89 v40.44,31.09 | v52.63,24.79 52.22,24.79
  Bottom 0.508: 52.69,28.51 v52.63,28.45 | 52.69,24.73 v52.63,24.79 | C36.P$1 v40.44,31.09 | C13.P$2 R19.P$1 32.25,24.85 33.33,23.77
  Bottom 0.813: IC1.8 40.51,31.01 v40.44,31.09 | 52.22,29.26 52.22,28.85 v52.63,28.45
  Bottom 1.422: C42.+ 32.41,22.86 33.33,23.77 38.41,28.85 39.86,28.85 IC1.8 51.98,29.51 52.12,29.36 | 52.12,29.36 52.22,29.26 | 52.12,29.36 52.08,29.32 C39.P$1 C41.P$2 52.08,24.93 52.22,24.79
  pour Top (no thermals): 38.4,12.6 38.4,13.41 39.22,13.41 39.22,15.24 32.51,15.24 32.51,12.6
  pour Top (no thermals): 34.34,12.6 30.68,12.6 29.06,14.22 29.06,22.15 30.89,23.98 33.93,23.98 34.54,23.37 34.54,20.73 33.73,19.91 32.11,19.91 31.09,18.9 31.09,16.46 32.51,15.04 34.34,15.04
V-  (via drill 0.33)
  Top 0.508: IC1.4 36.7,33.25 v36.58,33.12
  Top 0.813: U$4.20 54.41,22.91 v55.07,23.57 | U$4.1 54.41,30.32 v55.07,29.67
  Bottom 0.254: R21.P$1 C16.P$2 | C16.P$2 27.78,28.59 27.84,28.65 27.7,28.65 C16.P$2 | C16.P$2 27.64,28.65 28.01,29.02
  Bottom 0.508: C38.P$1 55.13,29.73 v55.07,29.67 | C40.P$2 55.13,23.51 v55.07,23.57 | v36.58,33.12 36.58,34 C37.P$1
  Bottom 1.422: C43.- 28.01,29.02 31.7,32.72 36.17,32.72 v36.58,33.12 40.44,33.12 41.05,32.51 52.22,32.51 v55.07,29.67 v55.07,23.57
  other vias: 25.81,11.18 25.81,10.16 27.03,11.18 27.03,10.16
  pour Top (no thermals): 24.18,12.19 28.04,12.19 28.04,9.55 23.37,9.55 23.37,11.38 24.18,11.38
  pour Bottom (no thermals): 25.2,9.55 28.04,9.55 28.04,17.27 26.42,18.9 25.6,18.9 24.18,20.32 24.18,27.43 24.79,28.04 24.79,30.48 24.38,30.89 21.74,30.89 20.32,29.46 20.32,28.04 21.74,26.62 21.74,18.69 25.2,15.24
VDD  (via drill 0.33)  (1 unrouted)
  Top 0.406: C25.P$2 14.01,32.37 U$1.21 14.01,35.36 v13.82,35.56 | v11.58,20.32 11.58,21.48 R28.P$1 | U$1.9 U$1.10 10.39,40 10.77,39.62 10.77,36.37 v11.58,35.56 11.22,35.2 U$1.16 8.52,35.2 R30.P$2 | 4.88,29.46 v5.08,29.26
  Bottom 0.406: v13.82,35.56 v11.58,35.56 11.38,35.56 10.97,35.15 10.97,27.64 9.14,25.81 7.32,25.81 | 7.32,25.81 6.91,25.81 6.1,24.99 6.1,20.73 6.5,20.32 v11.58,20.32 | v5.08,29.26 5.89,29.26 7.11,28.04 7.11,26.01 7.32,25.81

### Text on the board
bPlace: DAMP | vALPHA | Designed By: | Travis E